# Altium project ENGG3800S2_DANCEMACHINE_REV2.PrjPcb (part 2 of 2)

## Sheet INTERFACE_rev2.SchDoc
size A4; SheetNumber: 7; SheetTotal: 11
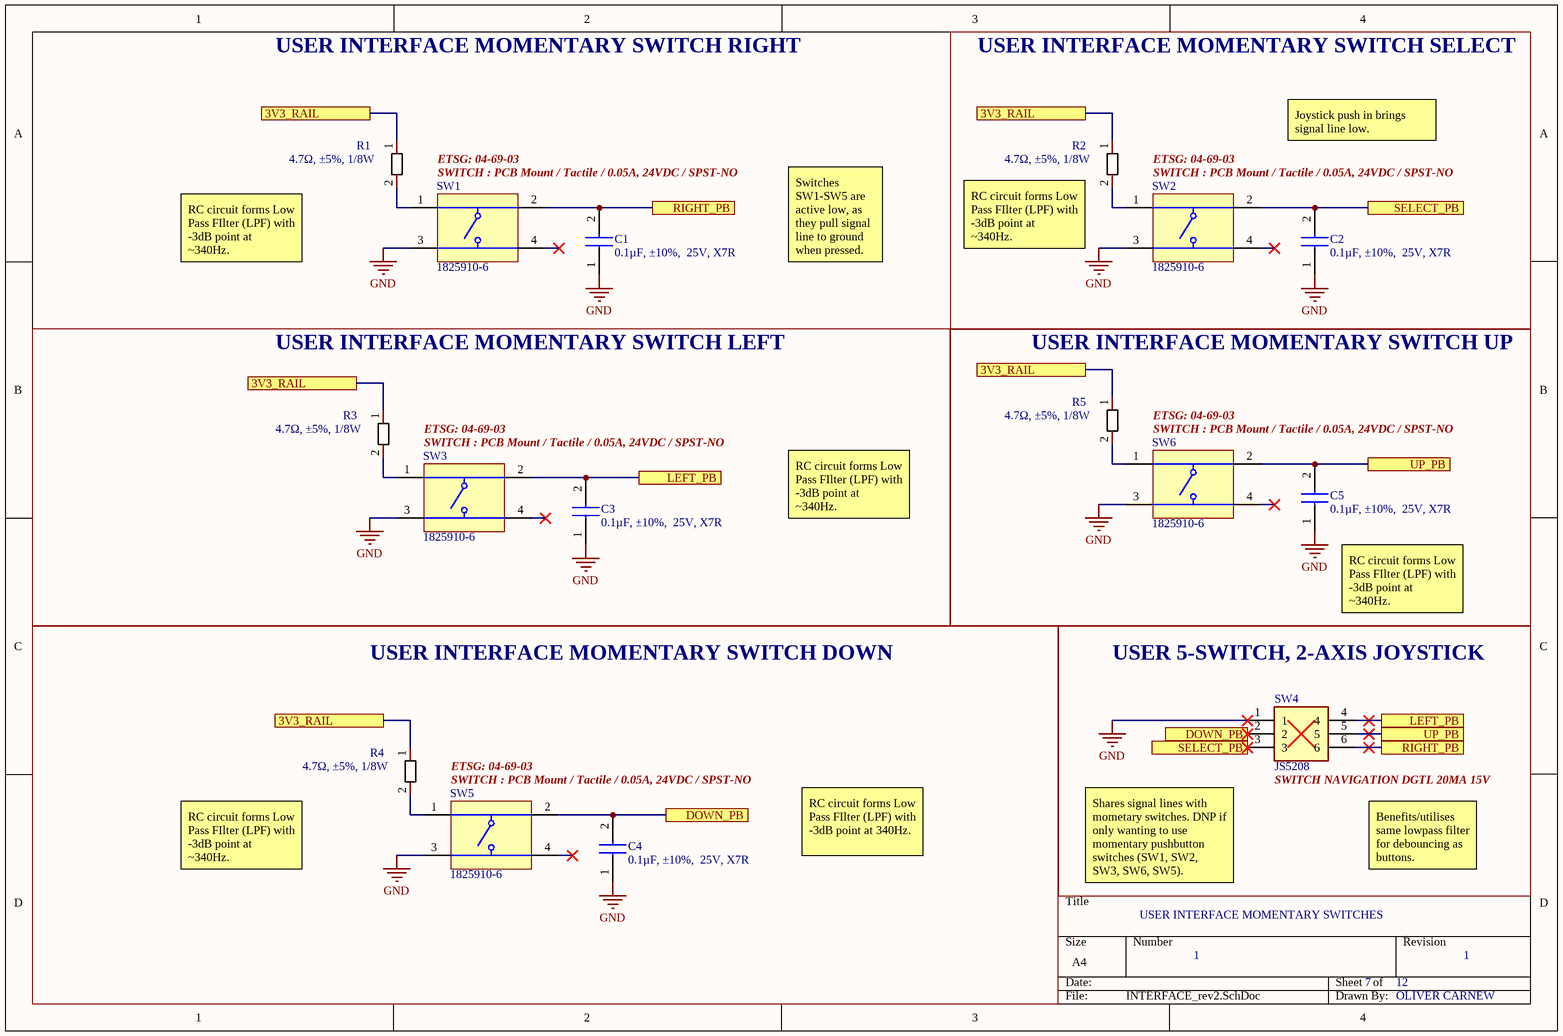
[diagram p6: INTERFACE_rev2.SchDoc]

### Parts
(Parts that share a designator on the sheet are numbered #1, #2 ... from top to bottom, then left to right.)
*#5  NC  (value not drawn)
C1  0.1µF, ±10%,  25V, X7R  [CAPC1005X55N]
C2  0.1µF, ±10%,  25V, X7R  [CAPC1005X55N]
C3  0.1µF, ±10%,  25V, X7R  [CAPC1005X55N]
C4  0.1µF, ±10%,  25V, X7R  [CAPC1005X55N]
C5  0.1µF, ±10%,  25V, X7R  [CAPC1005X55N]
R1  4.7Ω, ±5%, 1/8W  [SURFM RESISTOR]
R2  4.7Ω, ±5%, 1/8W  [SURFM RESISTOR]
R3  4.7Ω, ±5%, 1/8W  [SURFM RESISTOR]
R4  4.7Ω, ±5%, 1/8W  [SURFM RESISTOR]
R5  4.7Ω, ±5%, 1/8W  [SURFM RESISTOR]
SW1  1825910-6  [TECO-1825910-6_V]
SW2  1825910-6  [TECO-1825910-6_V]
SW3  1825910-6  [TECO-1825910-6_V]
SW4  JS5208  [JS5208]
SW5  1825910-6  [TECO-1825910-6_V]
SW6  1825910-6  [TECO-1825910-6_V]

### Blocks framed on the sheet
USER INTERFACE MOMENTARY SWITCH SELECT: C2 R2 SW2
USER INTERFACE MOMENTARY SWITCH LEFT: C3 R3 SW3
USER INTERFACE MOMENTARY SWITCH UP: C5 R5 SW6
USER INTERFACE MOMENTARY SWITCH DOWN: C4 R4 SW5
USER 5-SWITCH, 2-AXIS JOYSTICK: *#5 SW4

### Ports
3V3_RAIL, DOWN_PB, LEFT_PB, RIGHT_PB, SELECT_PB, UP_PB

### Nets
+3V3: R1.1 R2.1 R3.1 R4.1 R5.1 ; port 3V3_RAIL
GND: C1.1 C2.1 C3.1 C4.1 C5.1 SW1.3 SW2.3 SW3.3 SW4.1 SW5.3 SW6.3
PB_D: C4.2 SW4.2 SW5.2 ; port DOWN_PB
PB_L: C3.2 SW3.2 SW4.4 ; port LEFT_PB
PB_Ri: C1.2 SW1.2 SW4.6 ; port RIGHT_PB
PB_Sel: C2.2 SW2.2 SW4.3 ; port SELECT_PB
PB_U: C5.2 SW4.5 SW6.2 ; port UP_PB
NetR1_2: R1.2 SW1.1
NetR2_2: R2.2 SW2.1
NetR3_2: R3.2 SW3.1
NetR4_2: R4.2 SW5.1
NetR5_2: R5.2 SW6.1

Not connected (* = marked no-connect by the designer): SW1 4*; SW2 4*; SW3 4*; SW5 4*; SW6 4*

### Notes on the sheet
- USER INTERFACE MOMENTARY SWITCH RIGHT
- SWITCH : PCB Mount / Tactile / 0.05A, 24VDC / SPST-NO
- ETSG: 04-69-03
- Joystick push in brings signal line low.
- (near R2) RC circuit forms Low Pass FIlter (LPF) with -3dB point at ~340Hz.
- RC circuit forms Low Pass FIlter (LPF) with -3dB point at ~340Hz.
- Switches SW1-SW5 are active low, as they pull signal line to ground when pressed.
- (near C5) RC circuit forms Low Pass FIlter (LPF) with -3dB point at ~340Hz.
- SWITCH NAVIGATION DGTL 20MA 15V
- RC circuit forms Low Pass FIlter (LPF) with -3dB point at 340Hz.
- Shares signal lines with mometary switches. DNP if only wanting to use momentary pushbutton switches (SW1, SW2, SW3, SW6, SW5).
- USER INTERFACE MOMENTARY SWITCHES
- Benefits/utilises same lowpass filter for debouncing as buttons.
- 1
- 7
- 12
- OLIVER CARNEW

### Library data of the parts
C1-C5 = CL05B104KA5NNNC: Capacitor CAP CER 0.1UF 25V X7R 0402 CL05B104KA5NNNC; Manufacturer_Name: SAMSUNG; Datasheet Link: https://datasheet.datasheetarchive.com/originals/distributors/DKDS-19/372989.pdf; Height: 0.55mm; Manufacturer_Part_Number: CL05B104KA5NNNC; Mouser Part Number: 187-CL05B104KA5NNNC; Mouser Price/Stock: https://www.mouser.co.uk/ProductDetail/Samsung-Electro-Mechanics/CL05B104KA5NNNC?qs=Efv9o2T6U88DLyyMSzjXSQ%3D%3D; Arrow Part Number: CL05B104KA5NNNC; Arrow Price/Stock: https://www.arrow.com/en/products/cl05b104ka5nnnc/samsung-electro-mechanics?region=nac; Parameter 1: Capacitor CAP CER 0.1UF 25V X7R 0402 CL05B104KA5NNNC
R1-R5 = 0805-R: Chip Resistor, 4.7 KOhm, +/- 1%, 0.1 W, -55 to 155 degC, 0603 (1608 Metric), RoHS, Tape and Reel RC0603FR-074K7L
SW1-SW3 SW5 SW6 = CMP-1684-00021-1: Tact Switch, SPST-NO, 0.05 A, -35 to 85 degC, 4-Pin THD, RoHS, Bulk; Manufacturer: TE Connectivity; Maximum Contact Resistance: 100mOhm; Mechanical Life: 100000Cycles; Bushing Type: Unthreaded; Switch Configuration: OFF(ON); Maximum DC Voltage Rating: 24V; Contact Rating @ Voltage: 0.05A@24VDC; Actuator Color: Black; Body Orientation: Straight; Function: MomentaryContact; Illumination: N/R; Actuator Style: RoundButton; Actuator Material: PolybutyleneTerephthalate; Dielectric Strength: 500VAC; Pole Throw Configuration: SPST; Actuator Length: 1.4mm; Product Weight: N/A; Contact Material: CopperAlloy; Housing Material: N/A; Terminal Type: PCPins; Minimum Insulation Resistance: 100MOhm; Package Description: 4-Pin Through Hole Device, Body 5.99 x 5.99 mm, Pitch 6.5 mm; Part No: 1825910-6; Package Reference: THD; Base Material: N/A; Manufacturer URL: http://www.te.com; Contact Plating: Silver; RoHS: Yes; Datasheet Version: Rev. C9; Electrical Life: 100000Cycles; Maximum AC Voltage Rating: N/A; Thread Size: N/R; Operating Temperature: -35to85C; Mounting: ThroughHole; Dimension: 5.99x5mm; Datasheet URL: http://www.te.com/commerce/DocumentDelivery/DDEController?Action=showdoc&DocId=Customer+Drawing%7F1825910%7FC9%7Fpdf%7FEnglish%7FENG_CD_1825910_C9.pdf%7F1825910-6; Family: 1825910; Seal Location: N/A; Seal Description: N/A; Packaging: N/A
SW4 = JS5208: Switch; Manufacturer_Name: E-Switch; Datasheet Link: https://configured-product-images.s3.amazonaws.com/2D/specs/JS5208.pdf; Height: 12.2mm; Manufacturer_Part_Number: JS5208; Mouser Part Number: 612-JS5208; Mouser Price/Stock: https://www.mouser.co.uk/ProductDetail/E-Switch/JS5208?qs=f57gQzlyLiqOzqNCAUlPQg%3D%3D

## Sheet ARCADE_BUTTONS.SchDoc
size A4; SheetNumber: 8; SheetTotal: 11
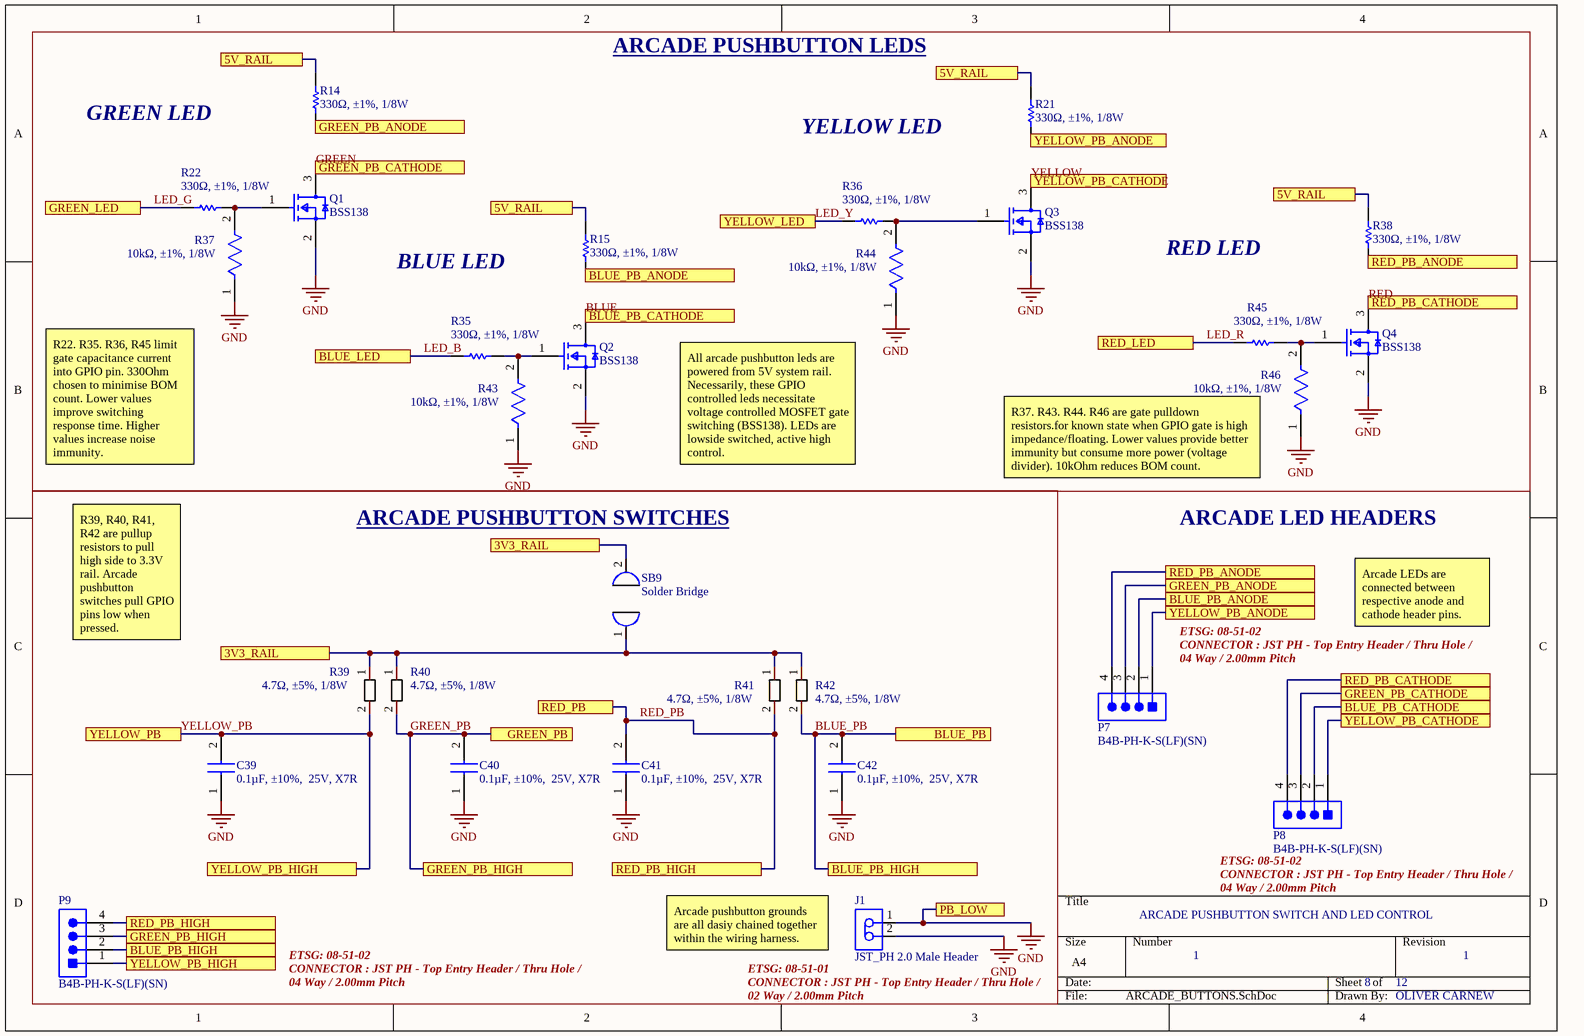
[diagram p7: ARCADE_BUTTONS.SchDoc]

### Parts
(Parts that share a designator on the sheet are numbered #1, #2 ... from top to bottom, then left to right.)
C39  0.1µF, ±10%,  25V, X7R  [CAPC1005X55N]
C40  0.1µF, ±10%,  25V, X7R  [CAPC1005X55N]
C41  0.1µF, ±10%,  25V, X7R  [CAPC1005X55N]
C42  0.1µF, ±10%,  25V, X7R  [CAPC1005X55N]
J1  JST_PH 2.0 Male Header  [JST-B2B-PH-K-S_V]
P7#1  B4B-PH-K-S(LF)(SN)  [JST-B4B-PH-K-S_V]
P8#1  B4B-PH-K-S(LF)(SN)  [JST-B4B-PH-K-S_V]
P9#1  B4B-PH-K-S(LF)(SN)  [JST-B4B-PH-K-S_V]
Q1  BSS138  [FP-318-08-IPC_B]
Q2  BSS138  [FP-318-08-IPC_B]
Q3  BSS138  [FP-318-08-IPC_B]
Q4  BSS138  [FP-318-08-IPC_B]
R14  330Ω, ±1%, 1/8W  [RESC1608X55X30ML20T10]
R15  330Ω, ±1%, 1/8W  [RESC1608X55X30ML20T10]
R21  330Ω, ±1%, 1/8W  [RESC1608X55X30ML20T10]
R22  330Ω, ±1%, 1/8W  [RESC1608X55X30ML20T10]
R35  330Ω, ±1%, 1/8W  [RESC1608X55X30ML20T10]
R36  330Ω, ±1%, 1/8W  [RESC1608X55X30ML20T10]
R37  10kΩ, ±1%, 1/8W  [FP-MCT0603-MFG]
R38  330Ω, ±1%, 1/8W  [RESC1608X55X30ML20T10]
R39  4.7Ω, ±5%, 1/8W  [SURFM RESISTOR]
R40  4.7Ω, ±5%, 1/8W  [SURFM RESISTOR]
R41  4.7Ω, ±5%, 1/8W  [SURFM RESISTOR]
R42  4.7Ω, ±5%, 1/8W  [SURFM RESISTOR]
R43  10kΩ, ±1%, 1/8W  [FP-MCT0603-MFG]
R44  10kΩ, ±1%, 1/8W  [FP-MCT0603-MFG]
R45  330Ω, ±1%, 1/8W  [RESC1608X55X30ML20T10]
R46  10kΩ, ±1%, 1/8W  [FP-MCT0603-MFG]
SB9  Solder Bridge  [SOLDER BRIDGE OPEN SMALL]

### Blocks framed on the sheet
ARCADE PUSHBUTTON SWITCHES: C39-C42 J1 P9#1 R39-R42 SB9

### Ports
3V3_RAIL, 5V_RAIL, BLUE_LED, BLUE_PB, BLUE_PB_ANODE, BLUE_PB_CATHODE, BLUE_PB_HIGH, GREEN_LED, GREEN_PB, GREEN_PB_ANODE, GREEN_PB_CATHODE, GREEN_PB_HIGH, PB_LOW, RED_LED, RED_PB, RED_PB_ANODE, RED_PB_CATHODE, RED_PB_HIGH, YELLOW_LED, YELLOW_PB, YELLOW_PB_ANODE, YELLOW_PB_CATHODE, YELLOW_PB_HIGH

### Nets
+3V3: R39.1 R40.1 R41.1 R42.1 SB9.1 SB9.2 ; port 3V3_RAIL
GND: C39.1 C40.1 C41.1 C42.1 J1.1 J1.2 Q1.2(S) Q2.2(S) Q3.2(S) Q4.2(S) R37.1 R43.1 R44.1 R46.1 ; port PB_LOW
V_SYS_IN: R14.2 R15.2 R21.2 R38.2 ; port 5V_RAIL
BLUE: P8#1.2 Q2.3(D) ; port BLUE_PB_CATHODE
BLUE_PB: C42.2 P9#1.2 R42.2 ; port BLUE_PB, port BLUE_PB_HIGH
GREEN: P8#1.3 Q1.3(D) ; port GREEN_PB_CATHODE
GREEN_PB: C40.2 P9#1.3 R40.2 ; port GREEN_PB, port GREEN_PB_HIGH
LED_B: R35.2 ; port BLUE_LED
LED_G: R22.2 ; port GREEN_LED
LED_R: R45.2 ; port RED_LED
LED_Y: R36.2 ; port YELLOW_LED
RED: P8#1.4 Q4.3(D) ; port RED_PB_CATHODE
RED_PB: C41.2 P9#1.4 R41.2 ; port RED_PB, port RED_PB_HIGH  [project net PB_Red]
YELLOW: P8#1.1 Q3.3(D) ; port YELLOW_PB_CATHODE
YELLOW_PB: C39.2 P9#1.1 R39.2 ; port YELLOW_PB, port YELLOW_PB_HIGH  [project net PB_Y]
NetP7#1_1: P7#1.1 R21.1 ; port YELLOW_PB_ANODE
NetP7#1_2: P7#1.2 R15.1 ; port BLUE_PB_ANODE
NetP7#1_3: P7#1.3 R14.1 ; port GREEN_PB_ANODE
NetP7#1_4: P7#1.4 R38.1 ; port RED_PB_ANODE
NetQ1_1: Q1.1(G) R22.1 R37.2
NetQ2_1: Q2.1(G) R35.1 R43.2
NetQ3_1: Q3.1(G) R36.1 R44.2
NetQ4_1: Q4.1(G) R45.1 R46.2

### Notes on the sheet
- ARCADE PUSHBUTTON LEDS
- GREEN LED
- YELLOW LED
- BLUE LED
- RED LED
- R22. R35. R36, R45 limit gate capacitance current into GPIO pin. 330Ohm chosen to minimise BOM count. Lower values improve switching response time. Higher values increase noise immunity.
- All arcade pushbutton leds are powered from 5V system rail. Necessarily, these GPIO controlled leds necessitate voltage controlled MOSFET gate switching (BSS138). LEDs are lowside switched, active high control.
- R37. R43. R44. R46 are gate pulldown resistors.for known state when GPIO gate is high impedance/floating. Lower values provide better immunity but consume more power (voltage divider). 10kOhm reduces BOM count.
- ARCADE LED HEADERS
- R39, R40, R41, R42 are pullup resistors to pull high side to 3.3V rail. Arcade pushbutton switches pull GPIO pins low when pressed.
- ETSG: 08-51-02
- (near P7#1) CONNECTOR : JST PH - Top Entry Header / Thru Hole /
- Arcade LEDs are connected between respective anode and cathode header pins.
- (near P7#1) 04 Way / 2.00mm Pitch
- ARCADE PUSHBUTTON SWITCH AND LED CONTROL
- CONNECTOR : JST PH - Top Entry Header / Thru Hole /
- 04 Way / 2.00mm Pitch
- Arcade pushbutton grounds are all dasiy chained together within the wiring harness.
- ETSG: 08-51-01
- (near J1) CONNECTOR : JST PH - Top Entry Header / Thru Hole /
- 1
- 8
- 12
- 02 Way / 2.00mm Pitch
- OLIVER CARNEW

### Library data of the parts
C39-C42 = CL05B104KA5NNNC: as C1 on sheet INTERFACE_rev2; Datasheet Link: https://datasheet.datasheetarchive.com/originals/distributors/DKDS-19/372989.pdf; Height: 0.55mm; Manufacturer_Part_Number: CL05B104KA5NNNC; Mouser Part Number: 187-CL05B104KA5NNNC; Mouser Price/Stock: https://www.mouser.co.uk/ProductDetail/Samsung-Electro-Mechanics/CL05B104KA5NNNC?qs=Efv9o2T6U88DLyyMSzjXSQ%3D%3D; Arrow Part Number: CL05B104KA5NNNC; Arrow Price/Stock: https://www.arrow.com/en/products/cl05b104ka5nnnc/samsung-electro-mechanics?region=nac; Parameter 1: Capacitor CAP CER 0.1UF 25V X7R 0402 CL05B104KA5NNNC
J1 = CMP-2000-05162-1: Male Header, Pitch 2 mm, 1 x 2 Position, Height 6 mm, Tail Length 3.4 mm, -25 to 85 degC, RoHS, Bulk B2B-PH-K-S(LF)(SN) / CONNECTOR : JST PH - Top Entry Header / Thru Hole / 02 Way / 2.00mm Pitch ___ 08-51-01; Pitch: 2mm; Style/Orientation: StraightHeader/Plug; No of Positions: 2; Datasheet Version: Nov-08; Datasheet URL: http://datasheet.octopart.com/B2B-PH-K-S%28LF%29%28SN%29-JST-datasheet-8324864.pdf; Manufacturer URL: http://www.jst.com/home2.html; Type: ShroudedHeader; Termination: Crimp; Manufacturer: JST
P7#1 P8#1 = CMP-2000-05165-1: Male Header, Pitch 2 mm, 1 x 4 Position, Height 6 mm, Tail Length 3.4 mm, -25 to 85 degC, RoHS, Bulk; Manufacturer: JST; No of Positions: 4; Style/Orientation: StraightHeader/Plug; Pitch: 2mm; Datasheet URL: http://datasheet.octopart.com/B4B-PH-K-S%28LF%29%28SN%29-JST-datasheet-10558886.pdf; Type: ShroudedHeader; Manufacturer URL: http://www.jst.com/home2.html; Termination: Crimp; Datasheet Version: Apr-09
P9#1 = CMP-2000-05165-1: Male Header, Pitch 2 mm, 1 x 4 Position, Height 6 mm, Tail Length 3.4 mm, -25 to 85 degC, RoHS, Bulk CONNECTOR : JST PH - Top Entry Header / Thru Hole / 04 Way / 2.00mm Pitch. ETSG: 08-51-02; No of Positions: 4; Style/Orientation: StraightHeader/Plug; Pitch: 2mm; Manufacturer: JST; Datasheet URL: http://datasheet.octopart.com/B4B-PH-K-S%28LF%29%28SN%29-JST-datasheet-10558886.pdf; Type: ShroudedHeader; Manufacturer URL: http://www.jst.com/home2.html; Termination: Crimp; Datasheet Version: Apr-09
Q1-Q4 = CMP-07173-000101-1: MOSFET N-CH 50V 220MA SOT-23; Turn-Off Delay Time: 20ns; Element Configuration: Single; Rds On Max: 3.5R; Gate to Source Voltage (Vgs): 20V; Threshold Voltage: 1.3V; Number of Elements: 1; Power Dissipation: 360mW; Rise Time: 9ns; Turn-On Delay Time: 2.5ns; Input Capacitance: 27pF; On-State Resistance: 6R; Lead Free: Lead Free; Length: 2.92mm; Width: 1.3mm; Drain to Source Breakdown Voltage: 50V; Min Operating Temperature: -55°C; REACH SVHC: No SVHC; Packaging: Tape and Reel; Radiation Hardening: No; Height: 0.93mm; Drain to Source Voltage (Vdss): 50V; Current Rating: 220mA; Voltage Rating (DC): 50V; Weight: 0.03g; Continuous Drain Current (ID): 220mA; Number of Pins: 3; Nominal Vgs: 1.3V; Max Power Dissipation: 360mW; Fall Time: 9ns; Drain to Source Resistance: 3.5R; Contact Plating: Tin; Case/Package: SOT-23; Package Quantity: 1; Dual Supply Voltage: 50V; Mount: Surface Mount; Termination: SMD/SMT; Max Operating Temperature: 150°C
R14 R15 R21 R22 R35 R36 R38 R45 = CMP-2000-01422-1: RK73H1JTTD3300F 330 Ohms ±1% 0.125W, 1/8W Chip Resistor 0603 (1608 Metric) Automotive AEC-Q200 Thick Film; Manufacturer: KOA Speer; Part Number: RK73H1JTTD3300F
R37 R43 R44 R46 = CMP-02407-001346-1: RES SMD 10KOHM 1% 1/8W 0603 MCT0603MC1002FP500; Voltage Rating: 75V; Power Rating: 125mW; Resistance: 10kR; Length: 1.6mm; Case Code (Metric): 1608; Composition: Thin Film; Height: 0.45mm; Weight: 7.1E-05oz; Min Operating Temperature: -55°C; Packaging: Tape and Reel; Width: 0.8mm; Case/Package: 0603; Tolerance: 1%; Termination: SMD/SMT; Package Quantity: 5000; Case Code (Imperial): 0603; Max Operating Temperature: 155°C
R39-R42 = 0805-R: as R1 on sheet INTERFACE_rev2
SB9 = SOLDER_BRIDGE_TDROP: Tension Fill Solder Bridge

## Sheet TP_STD_PERIPHERALS.SchDoc
size A4; SheetNumber: 9; SheetTotal: 11
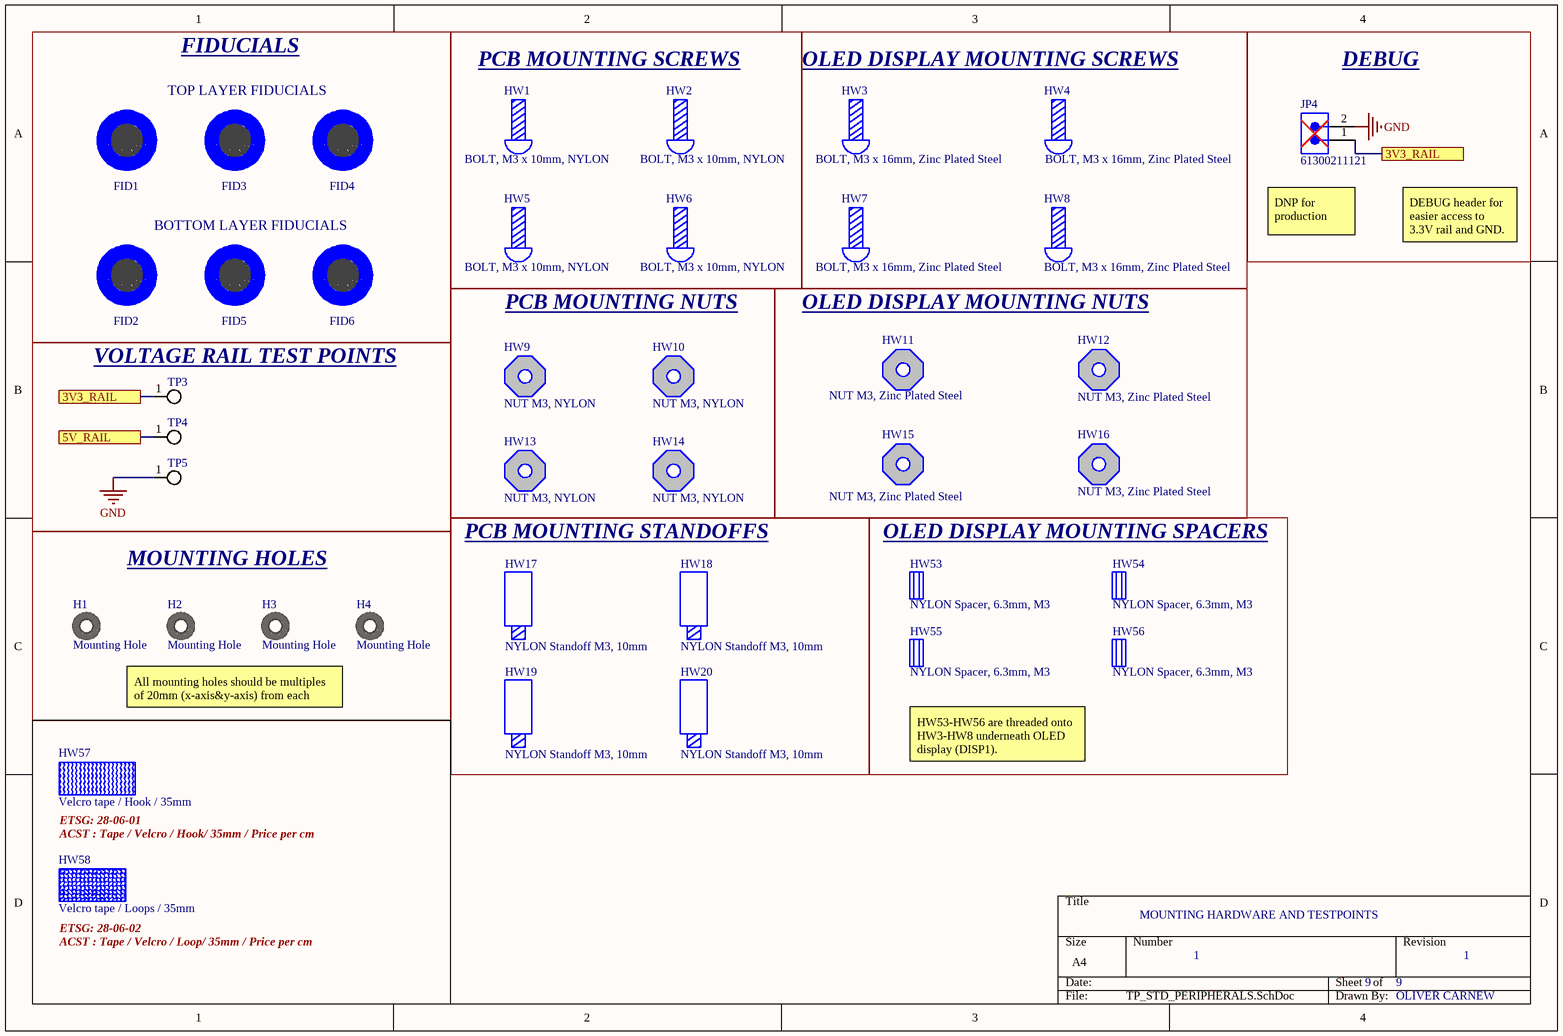
[diagram p8: TP_STD_PERIPHERALS.SchDoc]

### Parts
(Parts that share a designator on the sheet are numbered #1, #2 ... from top to bottom, then left to right.)
*#6  NC  (value not drawn)
FID1  Fiducial Mark  [FIDUCIAL_SMALL]  (value not drawn)
FID2  Fiducial Mark  [FIDUCIAL_SMALL]  (value not drawn)
FID3  Fiducial Mark  [FIDUCIAL_SMALL]  (value not drawn)
FID4  Fiducial Mark  [FIDUCIAL_SMALL]  (value not drawn)
FID5  Fiducial Mark  [FIDUCIAL_SMALL]  (value not drawn)
FID6  Fiducial Mark  [FIDUCIAL_SMALL]  (value not drawn)
H1  Mounting Hole  [M3_MOUNTING_HOLE_3_4_mm]
H2  Mounting Hole  [M3_MOUNTING_HOLE_3_4_mm]
H3  Mounting Hole  [M3_MOUNTING_HOLE_3_4_mm]
H4  Mounting Hole  [M3_MOUNTING_HOLE_3_4_mm]
HW1  BOLT, M3 x 10mm, NYLON
HW2  BOLT, M3 x 10mm, NYLON
HW3  BOLT, M3 x 16mm, Zinc Plated Steel
HW4  BOLT, M3 x 16mm, Zinc Plated Steel
HW5  BOLT, M3 x 10mm, NYLON
HW6  BOLT, M3 x 10mm, NYLON
HW7  BOLT, M3 x 16mm, Zinc Plated Steel
HW8  BOLT, M3 x 16mm, Zinc Plated Steel
HW9  NUT M3, NYLON
HW10  NUT M3, NYLON
HW11  NUT M3, Zinc Plated Steel
HW12  NUT M3, Zinc Plated Steel
HW13  NUT M3, NYLON
HW14  NUT M3, NYLON
HW15  NUT M3, Zinc Plated Steel
HW16  NUT M3, Zinc Plated Steel
HW17  NYLON Standoff M3, 10mm
HW18  NYLON Standoff M3, 10mm
HW19  NYLON Standoff M3, 10mm
HW20  NYLON Standoff M3, 10mm
HW53  NYLON Spacer, 6.3mm, M3
HW54  NYLON Spacer, 6.3mm, M3
HW55  NYLON Spacer, 6.3mm, M3
HW56  NYLON Spacer, 6.3mm, M3
HW57  Velcro tape / Hook / 35mm
HW58  Velcro tape / Loops / 35mm
JP4  61300211121  [61300211121]
TP3  Small testpoint 40mil  [TEST_POINT_SMALL]  (value not drawn)
TP4  Small testpoint 40mil  [TEST_POINT_SMALL]  (value not drawn)
TP5  Small testpoint 40mil  [TEST_POINT_SMALL]  (value not drawn)

### Blocks framed on the sheet
FIDUCIALS: FID1-FID6
PCB MOUNTING SCREWS: HW1 HW2 HW5 HW6
OLED DISPLAY MOUNTING SCREWS: HW3 HW4 HW7 HW8
DEBUG: *#6 JP4
PCB MOUNTING NUTS: HW9 HW10 HW13 HW14
OLED DISPLAY MOUNTING NUTS: HW11 HW12 HW15 HW16
VOLTAGE RAIL TEST POINTS: TP3-TP5
PCB MOUNTING STANDOFFS: HW17-HW20
OLED DISPLAY MOUNTING SPACERS: HW53-HW56
MOUNTING HOLES: H1-H4

### Ports
3V3_RAIL, 5V_RAIL

### Nets
+3V3: JP4.1 TP3.1 ; port 3V3_RAIL
GND: JP4.2 TP5.1
V_SYS_IN: TP4.1 ; port 5V_RAIL

### Notes on the sheet
- TOP LAYER FIDUCIALS
- BOTTOM LAYER FIDUCIALS
- DNP for production
- DEBUG header for easier access to 3.3V rail and GND.
- All mounting holes should be multiples of 20mm (x-axis&y-axis) from each other.
- HW53-HW56 are threaded onto HW3-HW8 underneath OLED display (DISP1).
- (near HW57) ETSG: 28-06-01
- (near HW57) ACST : Tape / Velcro / Hook/ 35mm / Price per cm
- MOUNTING HARDWARE AND TESTPOINTS
- (near HW58) ETSG: 28-06-02
- (near HW58) ACST : Tape / Velcro / Loop/ 35mm / Price per cm
- 1
- 9
- OLIVER CARNEW

### Library data of the parts
FID1-FID6 = FIDUCIAL_SMALL: Small 1mm/40mil pad with 40mm soldermask clearance
H1-H4 = M3_MOUNTING_HOLE: M3 Mounting hole (3.4mm)
HW1-HW8 = M3_SCREW
HW9-HW16 = NUT
HW17-HW20 = STANDOFF
HW53-HW56 = NYLON_STANDOFF_6_3_mm: Spacer / Female - Female / Nylon / Hexagonal / M3 x 06.3
HW57 = VELCRO_HOOKS: ETSG: 28-06-01 / ACST : Tape / Velcro / Hook / / 20mm / Price per cm
HW58 = VELCRO_LOOP: ETSG: 28-06-01 / ACST : Tape / Velcro / Hook / / 20mm / Price per cm
JP4 = CMP-1712-00002-6: NexarPartId: 20081794; Number of Contacts: 2; Pitch: 2.54mm; Connector Type: Male Pin; Voltage Rating: 250V; Current Rating: 3A; Gender: Male; Contact Resistance: 20mΩ; Height: 8.94mm; Lead Free: Lead Free; Number of Pins: 2; Termination: Through Hole; RoHS: Compliant; Lead Pitch: 2.54mm; REACH SVHC: No SVHC; Housing Material: PBT; Contact Mating Length: 5.9944mm; Min Operating Temperature: -40°C; Orientation: Vertical; Contact Material: Copper; Contact Gender: Male; Max Operating Temperature: 125°C; Number of Rows: 1; Number of Positions: 2; Packaging: Bulk; Contact Plating: Gold; Mount: Through Hole; Color: Black; Operating Supply Voltage: 250V
TP3-TP5 = TEST_POINT_SMALL: 40mil circular pad no hole

## Sheet CONNECTORS_WIRES.SchDoc
size A4; SheetNumber: 10; SheetTotal: 12
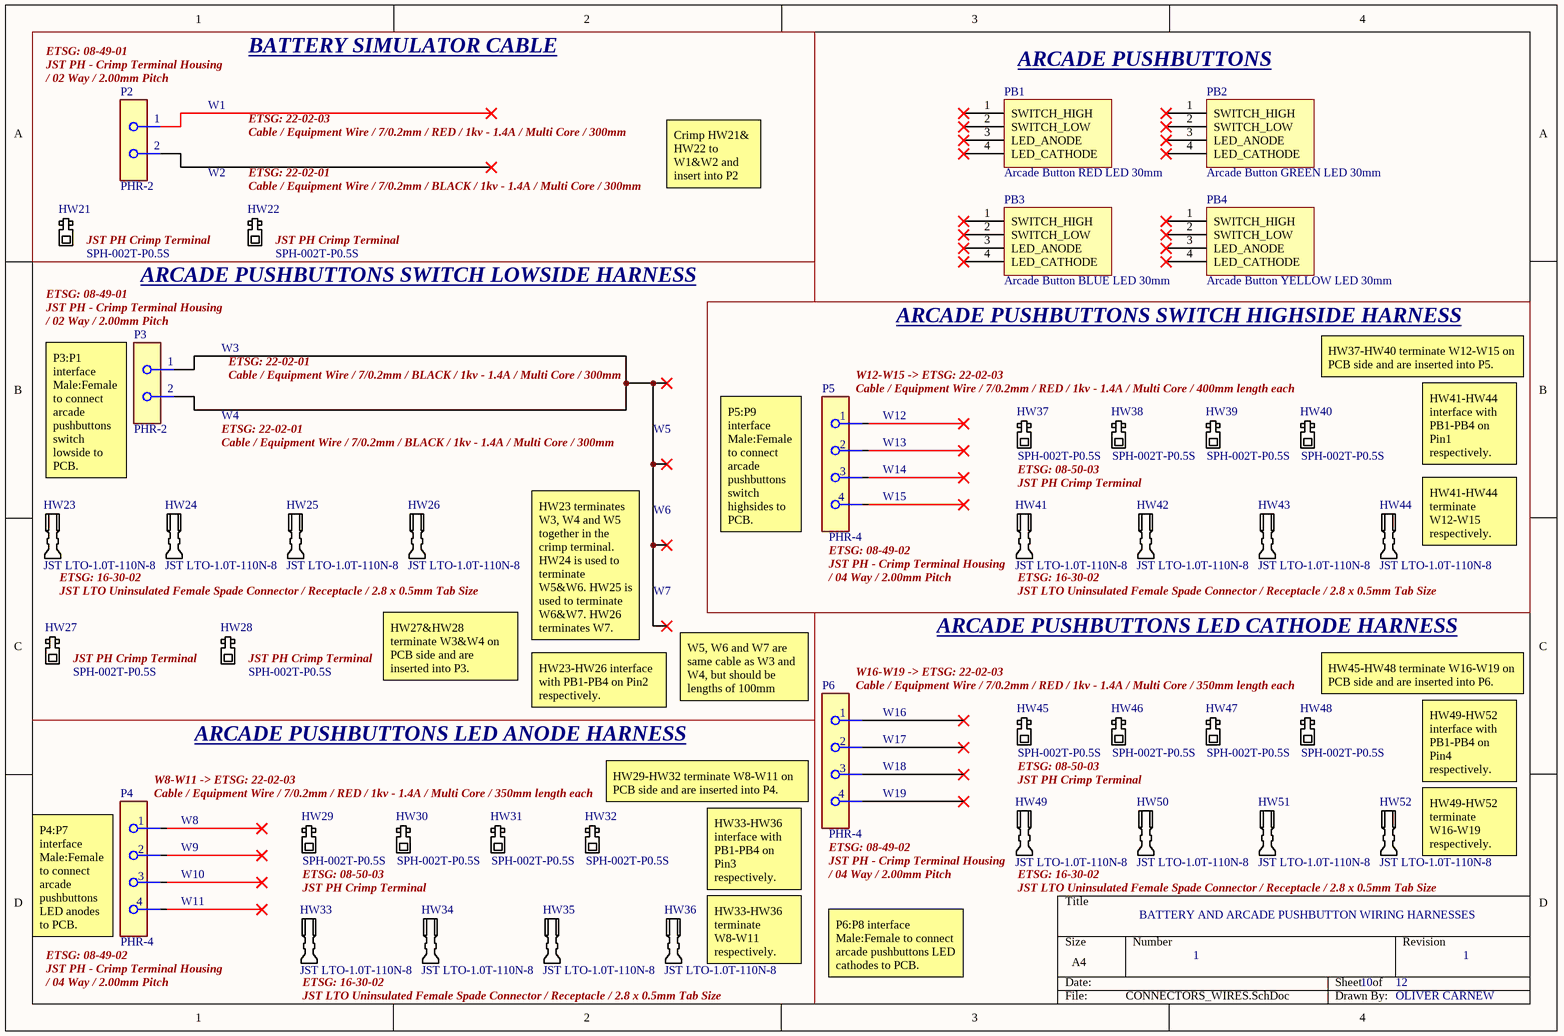
[diagram p9: CONNECTORS_WIRES.SchDoc]

### Parts
(Parts that share a designator on the sheet are numbered #1, #2 ... from top to bottom, then left to right.)
HW21  SPH-002T-P0.5S
HW22  SPH-002T-P0.5S
HW23  JST LTO-1.0T-110N-8
HW24  JST LTO-1.0T-110N-8
HW25  JST LTO-1.0T-110N-8
HW26  JST LTO-1.0T-110N-8
HW27  SPH-002T-P0.5S
HW28  SPH-002T-P0.5S
HW29  SPH-002T-P0.5S
HW30  SPH-002T-P0.5S
HW31  SPH-002T-P0.5S
HW32  SPH-002T-P0.5S
HW33  JST LTO-1.0T-110N-8
HW34  JST LTO-1.0T-110N-8
HW35  JST LTO-1.0T-110N-8
HW36  JST LTO-1.0T-110N-8
HW37  SPH-002T-P0.5S
HW38  SPH-002T-P0.5S
HW39  SPH-002T-P0.5S
HW40  SPH-002T-P0.5S
HW41  JST LTO-1.0T-110N-8
HW42  JST LTO-1.0T-110N-8
HW43  JST LTO-1.0T-110N-8
HW44  JST LTO-1.0T-110N-8
HW45  SPH-002T-P0.5S
HW46  SPH-002T-P0.5S
HW47  SPH-002T-P0.5S
HW48  SPH-002T-P0.5S
HW49  JST LTO-1.0T-110N-8
HW50  JST LTO-1.0T-110N-8
HW51  JST LTO-1.0T-110N-8
HW52  JST LTO-1.0T-110N-8
P2  PHR-2  [FP-PHR-2-MFG]
P3#1  PHR-2  [FP-PHR-2-MFG]
P4#1  PHR-4  [FP-PHR-4-MFG]
P5#1  PHR-4  [FP-PHR-4-MFG]
P6#1  PHR-4  [FP-PHR-4-MFG]
PB1  Arcade Button RED LED 30mm
PB2  Arcade Button GREEN LED 30mm
PB3  Arcade Button BLUE LED 30mm
PB4  Arcade Button YELLOW LED 30mm

### Blocks framed on the sheet
BATTERY SIMULATOR CABLE: HW21 HW22 P2
ARCADE PUSHBUTTONS SWITCH HIGHSIDE HARNESS: HW37-HW44 P5#1

### Nets

Not connected (* = marked no-connect by the designer): PB1 1(SWITCH_HIGH)* 2(SWITCH_LOW)* 3(LED_ANODE)* 4(LED_CATHODE)*; PB2 1(SWITCH_HIGH)* 2(SWITCH_LOW)* 3(LED_ANODE)* 4(LED_CATHODE)*; PB3 1(SWITCH_HIGH)* 2(SWITCH_LOW)* 3(LED_ANODE)* 4(LED_CATHODE)*; PB4 1(SWITCH_HIGH)* 2(SWITCH_LOW)* 3(LED_ANODE)* 4(LED_CATHODE)*

### Notes on the sheet
- ETSG: 08-49-01
- JST PH - Crimp Terminal Housing
- / 02 Way / 2.00mm Pitch
- W1
- ARCADE PUSHBUTTONS
- (near P2) 1
- (near P2) 2
- W2
- ETSG: 22-02-03
- Cable / Equipment Wire / 7/0.2mm / RED / 1kv - 1.4A / Multi Core / 300mm
- (near HW22) ETSG: 22-02-01
- JST PH Crimp Terminal
- (near HW22) Cable / Equipment Wire / 7/0.2mm / BLACK / 1kv - 1.4A / Multi Core / 300mm
- (near HW22) JST PH Crimp Terminal
- Crimp HW21& HW22 to  W1&W2 and insert into P2
- (near HW22) ARCADE PUSHBUTTONS SWITCH LOWSIDE HARNESS
- (near P3#1) 1
- W3
- ETSG: 22-02-01
- Cable / Equipment Wire / 7/0.2mm / BLACK / 1kv - 1.4A / Multi Core / 300mm
- (near HW37) W12-W15 -> ETSG: 22-02-03
- (near HW40) HW37-HW40 terminate W12-W15 on PCB side and are inserted into P5.
- (near P3#1) 2
- W4
- W5
- Cable / Equipment Wire / 7/0.2mm / RED / 1kv - 1.4A / Multi Core / 400mm length each
- W12
- (near P5#1) W13
- (near P3#1) P3:P1 interface Male:Female to connect arcade pushbuttons switch lowside to PCB.
- W6
- (near P5#1) W14
- (near P5#1) W15
- ETSG: 08-50-03
- HW41-HW44 interface with PB1-PB4 on Pin1 respectively.
- ETSG: 16-30-02
- (near P5#1) P5:P9 interface Male:Female to connect arcade pushbuttons switch highsides to PCB.
- ETSG: 08-49-02
- (near HW41) JST PH - Crimp Terminal Housing
- (near HW41) / 04 Way / 2.00mm Pitch
- (near HW41) ETSG: 16-30-02
- (near HW44) HW41-HW44 terminate W12-W15 respectively.
- JST LTO Uninsulated Female Spade Connector / Receptacle / 2.8 x 0.5mm Tab Size
- HW23 terminates W3, W4 and W5 together in the crimp terminal. HW24 is used to terminate W5&W6. HW25 is used to terminate W6&W7. HW26 terminates W7.
- W7
- ARCADE PUSHBUTTONS LED CATHODE HARNESS
- (near HW28) JST PH Crimp Terminal
- HW27&HW28 terminate W3&W4 on PCB side and are inserted into P3.
- HW23-HW26 interface with PB1-PB4 on Pin2 respectively.
- W5, W6 and W7 are same cable as W3 and W4, but should be lengths of 100mm
- (near HW45) W16-W19 -> ETSG: 22-02-03
- Cable / Equipment Wire / 7/0.2mm / RED / 1kv - 1.4A / Multi Core / 350mm length each
- W16
- (near HW48) HW45-HW48 terminate W16-W19 on PCB side and are inserted into P6.
- (near HW29) W8-W11 -> ETSG: 22-02-03
- ARCADE PUSHBUTTONS LED ANODE HARNESS
- (near P6#1) W17
- (near P6#1) W18
- HW49-HW52 interface with PB1-PB4 on Pin4 respectively.
- W8
- (near P4#1) W9
- HW29-HW32 terminate W8-W11 on PCB side and are inserted into P4.
- (near P6#1) W19
- (near HW52) HW49-HW52 terminate W16-W19 respectively.
- (near P4#1) W10
- (near P4#1) W11
- HW33-HW36 interface with PB1-PB4 on Pin3 respectively.
- (near HW49) JST PH - Crimp Terminal Housing
- (near HW49) / 04 Way / 2.00mm Pitch
- (near HW49) ETSG: 16-30-02
- BATTERY AND ARCADE PUSHBUTTON WIRING HARNESSES
- (near P4#1) P4:P7 interface Male:Female to connect arcade pushbuttons LED anodes to PCB.
- / 04 Way / 2.00mm Pitch
- (near HW33) ETSG: 16-30-02
- (near HW36) HW33-HW36 terminate W8-W11 respectively.
- P6:P8 interface Male:Female to connect arcade pushbuttons LED cathodes to PCB.
- 1
- 10
- 12
- OLIVER CARNEW
- (in symbol CMP-17439-000059-1) 2; 3

### Library data of the parts
HW23-HW26 HW33-HW36 HW41-HW44 HW49-HW52 = JST LTO-1.0T-110N-8: JST LTO Uninsulated Female Spade Connector / Receptacle / 2.8 x 0.5mm Tab Size
P2 P3#1 = CMP-17439-000064-1: CONN HOUSING PH 2POS 2MM WHITE; Wire Gauge (Min): 24AWG; Number of Positions: 2; Gender: Female; Working Voltage: 100V; Contact Resistance: 10mR; Connector Type: Receptacle; Wire Gauge (Max): 30AWG; Max Current Rating: 2A; Insulation Resistance: 1GR; REACH SVHC: No SVHC; Contact Plating: Tin; Contact Type: Female Socket; Housing Material: Polyamide; Height: 6.4mm; Weight: 0.0625lb; Pitch: 2mm; Number of Rows: 1; Number of Contacts: 2; Mount: Free Hanging; Color: Natural; Lead Free: Lead Free; Max Operating Temperature: 85°C; Min Operating Temperature: -25°C; Length: 5.8mm; Depth: 6.85mm; Termination: Crimp; Number of Pins: 2; Max Voltage Rating (AC): 100V; Contact Material: Bronze; Housing Color: White; Current Rating: 2A; Fastening Type: Detent; Width: 4.5mm; Packaging: Bulk; Orientation: Straight; Series: PH; Flammability Rating: UL94 V-0; Material: Nylon
P4#1 P5#1 P6#1 = CMP-17439-000059-1: CONN HOUSING PH 4POS 2MM WHITE; Insulation Resistance: 1GR; Gender: Receptacle; Contact Resistance: 10mR; Number of Contacts: 4; Working Voltage: 100V; Current Rating: 2A; Min Operating Temperature: -25°C; Flammability Rating: UL94 V-0; Pitch: 2mm; Contact Plating: Tin; Lead Free: Lead Free; Color: Natural; Depth: 6.85mm; Weight: 0.0625lb; Length: 9.8mm; Height: 6.4mm; Housing Material: Nylon; REACH SVHC: No SVHC; Termination: Crimp; Series: PH; Housing Color: Natural; Connector Type: Receptacle; Number of Rows: 1; Contact Type: Female Socket; Number of Positions: 4; Fastening Type: Detent; Width: 4.5mm; Packaging: Bulk; Orientation: Straight; Material: Nylon; Max Operating Temperature: 85°C; Number of Pins: 4; Contact Material: Bronze; Mount: Free Hanging
PB1-PB4 = ARCADE_PUSHBUTTON: Ausleaf.

## Sheet LED_MATRIX.SchDoc
size A4; SheetNumber: 11; SheetTotal: 12
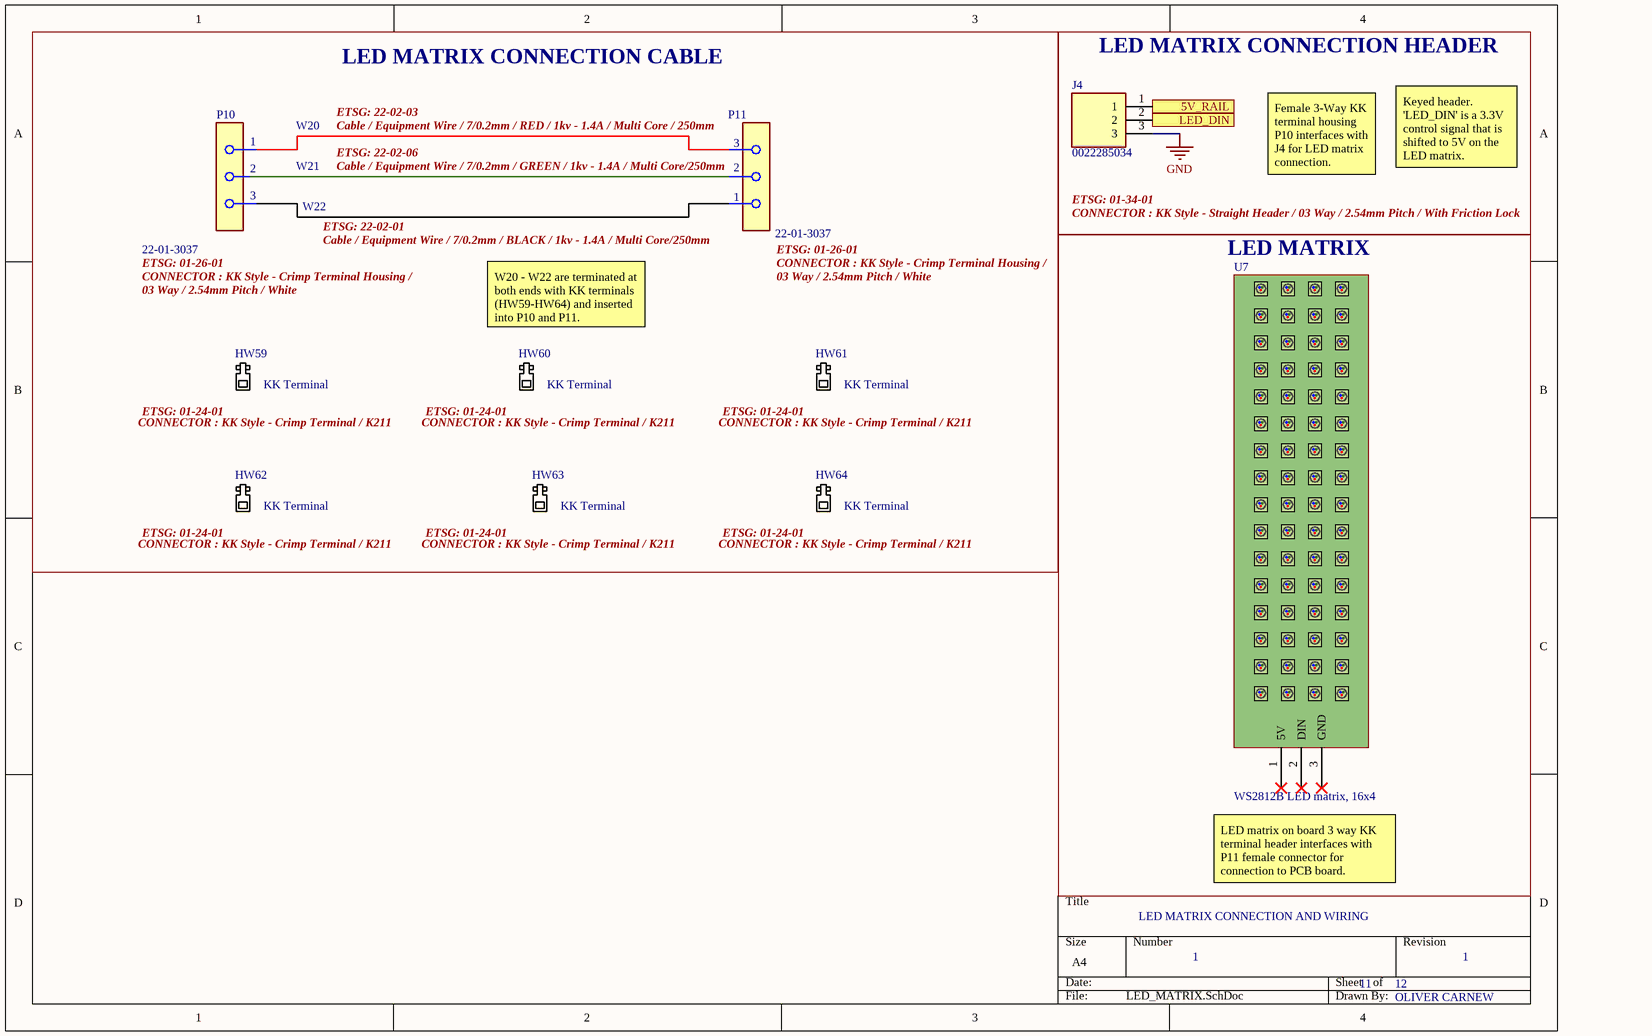
[diagram p10: LED_MATRIX.SchDoc]

### Parts
(Parts that share a designator on the sheet are numbered #1, #2 ... from top to bottom, then left to right.)
HW59  KK Terminal
HW60  KK Terminal
HW61  KK Terminal
HW62  KK Terminal
HW63  KK Terminal
HW64  KK Terminal
J4#1  0022285034  [0022285034]
P10#1  22-01-3037  [FP-22-01-3037-MFG]
P11#1  22-01-3037  [FP-22-01-3037-MFG]
U7#1  WS2812B LED matrix, 16x4

### Blocks framed on the sheet
LED MATRIX CONNECTION CABLE: HW59-HW64 P10#1 P11#1
LED MATRIX CONNECTION HEADER: J4#1
LED MATRIX: U7#1

### Ports
5V_RAIL, LED_DIN

### Nets
GND: J4#1.3
V_SYS_IN: J4#1.1 ; port 5V_RAIL
NetJ4#1_2: J4#1.2 ; port LED_DIN

Not connected (* = marked no-connect by the designer): U7#1 1(5V)* 2(DIN)* 3(GND)*

### Notes on the sheet
- ETSG: 22-02-03
- (near P10#1) 1
- (near P10#1) 2
- W20
- W21
- (near P11#1) Cable / Equipment Wire / 7/0.2mm / RED / 1kv - 1.4A / Multi Core / 250mm
- ETSG: 22-02-06
- (near P11#1) Cable / Equipment Wire / 7/0.2mm / GREEN / 1kv - 1.4A / Multi Core/250mm
- (near P11#1) 2
- (near P11#1) 3
- Female 3-Way KK terminal housing P10 interfaces with J4 for LED matrix connection.
- Keyed header. 'LED_DIN' is a 3.3V control signal that is shifted to 5V on the LED matrix.
- (near P10#1) 3
- W22
- ETSG: 22-02-01
- Cable / Equipment Wire / 7/0.2mm / BLACK / 1kv - 1.4A / Multi Core/250mm
- (near P11#1) 1
- ETSG: 01-34-01
- CONNECTOR : KK Style - Straight Header / 03 Way / 2.54mm Pitch / With Friction Lock
- ETSG: 01-26-01
- CONNECTOR : KK Style - Crimp Terminal Housing /
- 03 Way / 2.54mm Pitch / White
- (near HW60) W20 - W22 are terminated at both ends with KK terminals (HW59-HW64) and inserted into P10 and P11.
- CONNECTOR : KK Style - Crimp Terminal / K211
- (near HW59) ETSG: 01-24-01
- (near HW60) ETSG: 01-24-01
- (near HW61) ETSG: 01-24-01
- (near HW62) CONNECTOR : KK Style - Crimp Terminal / K211
- (near HW62) ETSG: 01-24-01
- (near HW63) CONNECTOR : KK Style - Crimp Terminal / K211
- (near HW63) ETSG: 01-24-01
- (near HW64) CONNECTOR : KK Style - Crimp Terminal / K211
- (near HW64) ETSG: 01-24-01
- LED MATRIX CONNECTION AND WIRING
- LED matrix on board 3 way KK terminal header interfaces with P11 female connector for connection to PCB board.
- 1
- 11
- 12
- OLIVER CARNEW

### Library data of the parts
HW59-HW64 = SPH-002T-P0.5S: CONNECTOR : KK Style - Crimp Terminal Housing / 03 Way / 2.54mm Pitch / White / ETSG 01-26-01
J4#1 = 0022285034: Connector; Manufacturer_Name: Molex; Datasheet Link: https://www.molex.com/content/dam/molex/molex-dot-com/products/automated/en-us/salesdrawingpdf/423/42375/022285034_sd.pdf?inline; Height: 10.67mm; Manufacturer_Part_Number: 0022285034; Arrow Part Number: 0022285034; Arrow Price/Stock: https://www.arrow.com/en/products/0022285034/molex?utm_currency=USD&region=nac
P10#1 P11#1 = CMP-04776-000467-1: CONN HOUS 3POS .100 W/RAMP/RIB; Number of Circuits: 3; Max Current Rating: 4A; Glow Wire Compliant: Non-compliant; Gender: Female; Connector Type: Receptacle; Approvals: UL; Voltage Rating: 250V; Pitch: 2.54mm; Halogen Free: Low Halogen; Length: 8.18mm; Depth: 12.7mm; Housing Material: Nylon; Number of Rows: 1; Termination: Crimp; Height: 4.82mm; Orientation: Straight; Housing Color: White; Material: Nylon; Max Operating Temperature: 75°C; Fastening Type: Ramp; Radiation Hardening: No; Lead Free: Lead Free; Flammability Rating: UL94 V-0; Series: 2695; Min Operating Temperature: 0°C; Number of Contacts: 3; Packaging: Bulk; Contact Material: Bronze; Number of Positions: 3; Color: White; Contact Type: Non-Gendered; Mount: Free Hanging; Width: 4.82mm
U7#1 = LED_MATRIX

## Sheet WIRING_DIAGRAM.SchDoc
size A4; SheetNumber: 12; SheetTotal: 12
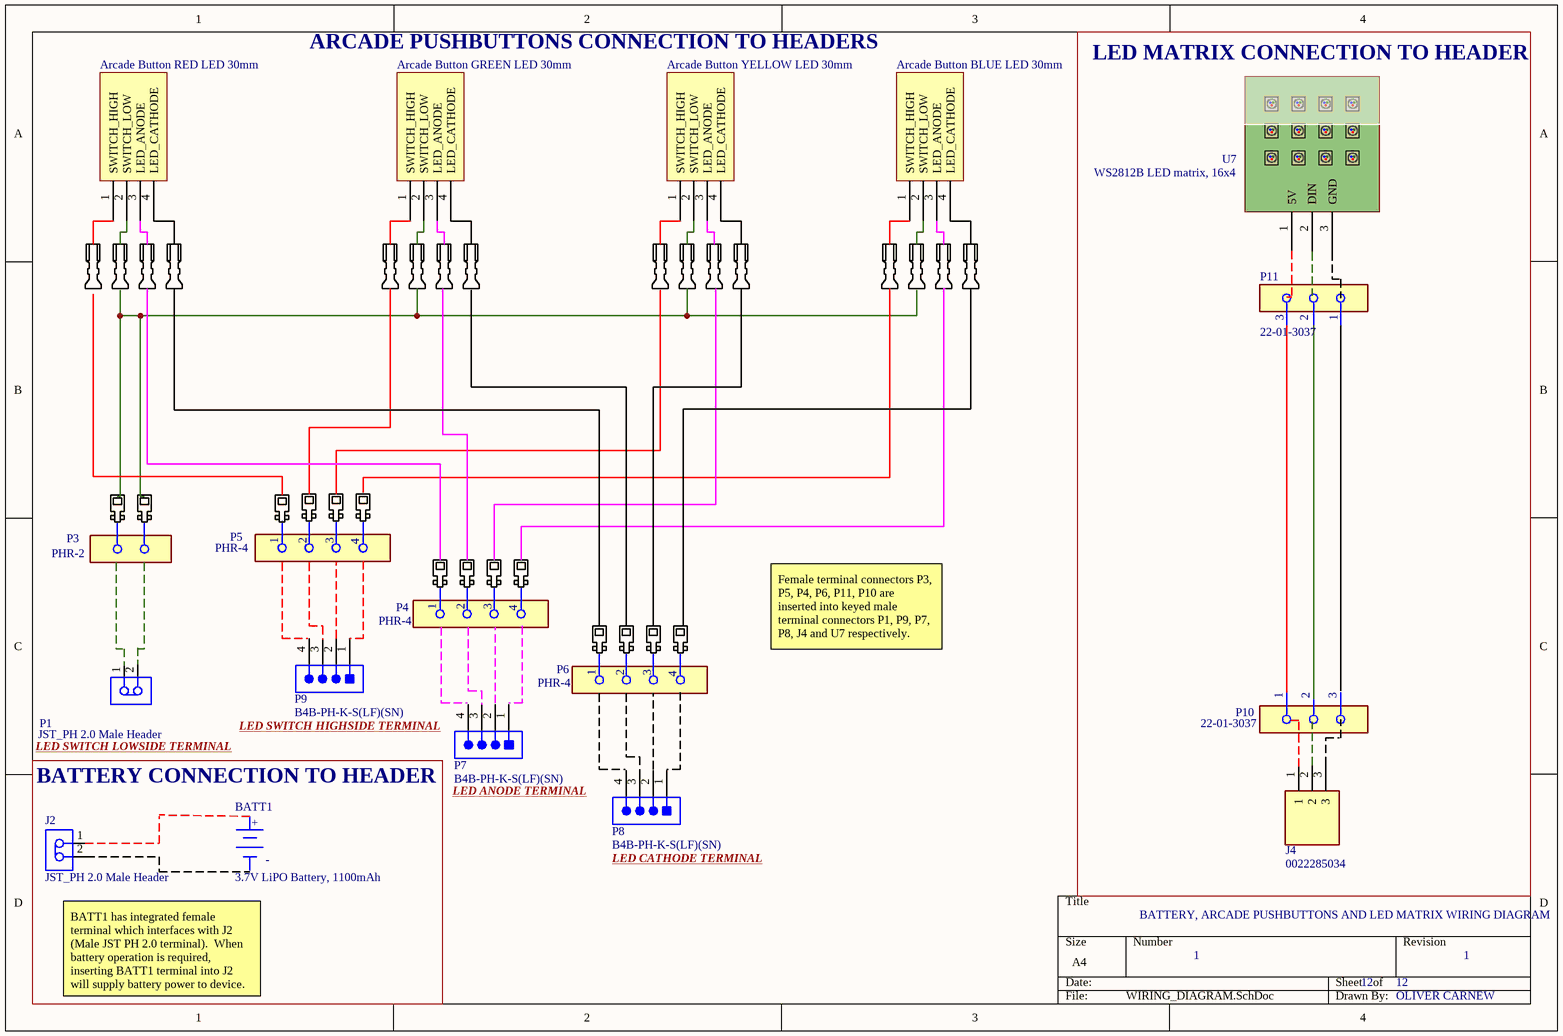
[diagram p11: WIRING_DIAGRAM.SchDoc]

### Parts
(Parts that share a designator on the sheet are numbered #1, #2 ... from top to bottom, then left to right.)
BATT1  3.7V LiPO Battery, 1100mAh  [FP-BR1225-MFG]
HW65  JST LTO-1.0T-110N-8  (value not drawn)
HW66  JST LTO-1.0T-110N-8  (value not drawn)
HW67  JST LTO-1.0T-110N-8  (value not drawn)
HW68  JST LTO-1.0T-110N-8  (value not drawn)
HW69  JST LTO-1.0T-110N-8  (value not drawn)
HW70  JST LTO-1.0T-110N-8  (value not drawn)
HW71  JST LTO-1.0T-110N-8  (value not drawn)
HW72  JST LTO-1.0T-110N-8  (value not drawn)
HW73  JST LTO-1.0T-110N-8  (value not drawn)
HW74  JST LTO-1.0T-110N-8  (value not drawn)
HW75  JST LTO-1.0T-110N-8  (value not drawn)
HW76  JST LTO-1.0T-110N-8  (value not drawn)
HW77  JST LTO-1.0T-110N-8  (value not drawn)
HW78  JST LTO-1.0T-110N-8  (value not drawn)
HW79  JST LTO-1.0T-110N-8  (value not drawn)
HW80  JST LTO-1.0T-110N-8  (value not drawn)
HW81  SPH-002T-P0.5S  (value not drawn)
HW82  SPH-002T-P0.5S  (value not drawn)
HW83  SPH-002T-P0.5S  (value not drawn)
HW84  SPH-002T-P0.5S  (value not drawn)
HW85  SPH-002T-P0.5S  (value not drawn)
HW86  SPH-002T-P0.5S  (value not drawn)
HW87  SPH-002T-P0.5S  (value not drawn)
HW88  SPH-002T-P0.5S  (value not drawn)
HW89  SPH-002T-P0.5S  (value not drawn)
HW90  SPH-002T-P0.5S  (value not drawn)
HW91  SPH-002T-P0.5S  (value not drawn)
HW92  SPH-002T-P0.5S  (value not drawn)
HW93  SPH-002T-P0.5S  (value not drawn)
HW94  SPH-002T-P0.5S  (value not drawn)
J2#2  JST_PH 2.0 Male Header  [JST-B2B-PH-K-S_V]
J4#2  0022285034  [0022285034]
P1  JST_PH 2.0 Male Header  [JST-B2B-PH-K-S_V]
P3#2  PHR-2  [FP-PHR-2-MFG]
P4#2  PHR-4  [FP-PHR-4-MFG]
P5#2  PHR-4  [FP-PHR-4-MFG]
P6#2  PHR-4  [FP-PHR-4-MFG]
P7#2  B4B-PH-K-S(LF)(SN)  [JST-B4B-PH-K-S_V]
P8#2  B4B-PH-K-S(LF)(SN)  [JST-B4B-PH-K-S_V]
P9#2  B4B-PH-K-S(LF)(SN)  [JST-B4B-PH-K-S_V]
P10#2  22-01-3037  [FP-22-01-3037-MFG]
P11#2  22-01-3037  [FP-22-01-3037-MFG]
PB5  Arcade Button RED LED 30mm
PB6  Arcade Button GREEN LED 30mm
PB7  Arcade Button YELLOW LED 30mm
PB8  Arcade Button BLUE LED 30mm
U7#2  WS2812B LED matrix, 16x4

### Blocks framed on the sheet
LED MATRIX CONNECTION TO HEADER: J4#2 P10#2 P11#2 U7#2
BATTERY CONNECTION TO HEADER: BATT1 J2#2

### Nets

Not connected (* = marked no-connect by the designer): J2#2 1 2; J4#2 1 2 3; P1 1 2; P7#2 1 2 3 4; P8#2 1 2 3 4; P9#2 1 2 3 4; PB5 1(SWITCH_HIGH) 2(SWITCH_LOW) 3(LED_ANODE) 4(LED_CATHODE); PB6 1(SWITCH_HIGH) 2(SWITCH_LOW) 3(LED_ANODE) 4(LED_CATHODE); PB7 1(SWITCH_HIGH) 2(SWITCH_LOW) 3(LED_ANODE) 4(LED_CATHODE); PB8 1(SWITCH_HIGH) 2(SWITCH_LOW) 3(LED_ANODE) 4(LED_CATHODE); U7#2 1(5V) 2(DIN) 3(GND)

### Notes on the sheet
- ARCADE PUSHBUTTONS CONNECTION TO HEADERS
- (near P11#2) 3
- (near P11#2) 2
- (near P11#2) 1
- Female terminal connectors P3, P5, P4, P6, P11, P10 are inserted into keyed male terminal connectors P1, P9, P7, P8, J4 and U7 respectively.
- (near P10#2) 1
- (near P10#2) 2
- (near P10#2) 3
- LED SWITCH LOWSIDE TERMINAL
- LED SWITCH HIGHSIDE TERMINAL
- LED ANODE TERMINAL
- LED CATHODE TERMINAL
- BATTERY, ARCADE PUSHBUTTONS AND LED MATRIX WIRING DIAGRAM
- BATT1 has integrated female terminal which interfaces with J2 (Male JST PH 2.0 terminal).  When battery operation is required, inserting BATT1 terminal into J2 will supply battery power to device.
- 1
- 12
- OLIVER CARNEW
- (in symbol CMP-05417-000012-1) +; -
- (in symbol CMP-17439-000059-1) 2; 3

### Library data of the parts
BATT1 = CMP-05417-000012-1: BATTERY LITHIUM 3V COIN 12.5MM; Manufacturer: Panasonic; Manufacturer Part Number: BR1225; ComponentLink2Description: Datasheet; Octopart: https://octopart.com/br1225-panasonic-39386830; Device Class L3: unset; Device Class L2: unset; ComponentLink2URL: https://industrial.panasonic.com/cdbs/www-data/pdf2/AAA4000/AAA4000C206.pdf; Temperature Range High: +80°C; Device Class L1: Passive Components; Mouser Description: Coin Cell Battery 3V 12 X 2.5 mm 48mA; Automotive: No; Category: Batt; Temperature Range Low: -30°C; Temperature: -30°C to +80°C; Digikey Description: BATTERY LITHIUM 3V COIN 12.5MM; Package: BR1225
HW65-HW80 = JST LTO-1.0T-110N-8: JST LTO Uninsulated Female Spade Connector / Receptacle / 2.8 x 0.5mm Tab Size
J2#2 P1 = CMP-2000-05162-1: Male Header, Pitch 2 mm, 1 x 2 Position, Height 6 mm, Tail Length 3.4 mm, -25 to 85 degC, RoHS, Bulk B2B-PH-K-S(LF)(SN); Manufacturer: JST; Pitch: 2mm; Style/Orientation: StraightHeader/Plug; No of Positions: 2; Datasheet Version: Nov-08; Datasheet URL: http://datasheet.octopart.com/B2B-PH-K-S%28LF%29%28SN%29-JST-datasheet-8324864.pdf; Manufacturer URL: http://www.jst.com/home2.html; Type: ShroudedHeader; Termination: Crimp
J4#2 = 0022285034: Connector; Manufacturer_Name: Molex; Datasheet Link: https://www.molex.com/content/dam/molex/molex-dot-com/products/automated/en-us/salesdrawingpdf/423/42375/022285034_sd.pdf?inline; Height: 10.67mm; Manufacturer_Part_Number: 0022285034; Arrow Part Number: 0022285034; Arrow Price/Stock: https://www.arrow.com/en/products/0022285034/molex?utm_currency=USD&region=nac
P3#2 = CMP-17439-000064-1: CONN HOUSING PH 2POS 2MM WHITE; Wire Gauge (Min): 24AWG; Number of Positions: 2; Gender: Female; Working Voltage: 100V; Contact Resistance: 10mR; Connector Type: Receptacle; Wire Gauge (Max): 30AWG; Max Current Rating: 2A; Insulation Resistance: 1GR; REACH SVHC: No SVHC; Contact Plating: Tin; Contact Type: Female Socket; Housing Material: Polyamide; Height: 6.4mm; Weight: 0.0625lb; Pitch: 2mm; Number of Rows: 1; Number of Contacts: 2; Mount: Free Hanging; Color: Natural; Lead Free: Lead Free; Max Operating Temperature: 85°C; Min Operating Temperature: -25°C; Length: 5.8mm; Depth: 6.85mm; Termination: Crimp; Number of Pins: 2; Max Voltage Rating (AC): 100V; Contact Material: Bronze; Housing Color: White; Current Rating: 2A; Fastening Type: Detent; Width: 4.5mm; Packaging: Bulk; Orientation: Straight; Series: PH; Flammability Rating: UL94 V-0; Material: Nylon
P4#2 P5#2 P6#2 = CMP-17439-000059-1: CONN HOUSING PH 4POS 2MM WHITE; Insulation Resistance: 1GR; Gender: Receptacle; Contact Resistance: 10mR; Number of Contacts: 4; Working Voltage: 100V; Current Rating: 2A; Min Operating Temperature: -25°C; Flammability Rating: UL94 V-0; Pitch: 2mm; Contact Plating: Tin; Lead Free: Lead Free; Color: Natural; Depth: 6.85mm; Weight: 0.0625lb; Length: 9.8mm; Height: 6.4mm; Housing Material: Nylon; REACH SVHC: No SVHC; Termination: Crimp; Series: PH; Housing Color: Natural; Connector Type: Receptacle; Number of Rows: 1; Contact Type: Female Socket; Number of Positions: 4; Fastening Type: Detent; Width: 4.5mm; Packaging: Bulk; Orientation: Straight; Material: Nylon; Max Operating Temperature: 85°C; Number of Pins: 4; Contact Material: Bronze; Mount: Free Hanging
P7#2 P8#2 P9#2 = CMP-2000-05165-1: Male Header, Pitch 2 mm, 1 x 4 Position, Height 6 mm, Tail Length 3.4 mm, -25 to 85 degC, RoHS, Bulk; Manufacturer: JST; No of Positions: 4; Style/Orientation: StraightHeader/Plug; Pitch: 2mm; Datasheet URL: http://datasheet.octopart.com/B4B-PH-K-S%28LF%29%28SN%29-JST-datasheet-10558886.pdf; Type: ShroudedHeader; Manufacturer URL: http://www.jst.com/home2.html; Termination: Crimp; Datasheet Version: Apr-09
P10#2 P11#2 = CMP-04776-000467-1: as P10#1 on sheet LED_MATRIX; Halogen Free: Low Halogen; Length: 8.18mm; Depth: 12.7mm; Housing Material: Nylon; Number of Rows: 1; Termination: Crimp; Height: 4.82mm; Orientation: Straight; Housing Color: White; Material: Nylon; Max Operating Temperature: 75°C; Fastening Type: Ramp; Radiation Hardening: No; Lead Free: Lead Free; Flammability Rating: UL94 V-0; Series: 2695; Min Operating Temperature: 0°C; Number of Contacts: 3; Packaging: Bulk; Contact Material: Bronze; Number of Positions: 3; Color: White; Contact Type: Non-Gendered; Mount: Free Hanging; Width: 4.82mm
PB5-PB8 = ARCADE_PUSHBUTTON: Ausleaf.
U7#2 = LED_MATRIX_CUTOFF

## Nets that join several sheets
+3V3: MCU_REV2 (16 pins), 3.3V_SUPPLY (C18.2 LED3.2 R19.1 U2.5), AUDIO_REV2 (6 pins), SD_CARD_REV2 (11 pins), INTERFACE_rev2 (5 pins), ARCADE_BUTTONS (6 pins), TP_STD_PERIPHERALS (JP4.1 TP3.1)
GND: MCU_REV2 (19 pins), POWER_BATT_REV2 (25 pins), POWER_REV2 (C19.1 C20.2 C21.2), 3.3V_SUPPLY (8 pins), AUDIO_REV2 (7 pins), SD_CARD_REV2 (C36.1 C37.1 C38.1 J5.6), INTERFACE_rev2 (11 pins), ARCADE_BUTTONS (14 pins), TP_STD_PERIPHERALS (JP4.2 TP5.1), LED_MATRIX (J4#1.3)
V_SYS_IN: 3.3V_SUPPLY (6 pins), ARCADE_BUTTONS (R14.2 R15.2 R21.2 R38.2), TP_STD_PERIPHERALS (TP4.1), LED_MATRIX (J4#1.1)
BLUE_PB: MCU_REV2 (U5.20), ARCADE_BUTTONS (C42.2 P9#1.2 R42.2)
GREEN_PB: MCU_REV2 (U5.19), ARCADE_BUTTONS (C40.2 P9#1.3 R40.2)
LED_B: MCU_REV2 (U5.31), ARCADE_BUTTONS (R35.2)
LED_G: MCU_REV2 (U5.29), ARCADE_BUTTONS (R22.2)
LED_R: MCU_REV2 (U5.30), ARCADE_BUTTONS (R45.2)
LED_Y: MCU_REV2 (U5.38), ARCADE_BUTTONS (R36.2)
NetJ4#1_2: MCU_REV2 (U5.11), LED_MATRIX (J4#1.2)
NetJP1_1: POWER_REV2 (JP1.1 JP5.1), 3.3V_SUPPLY (SW7.3)
NetR18_1: MCU_REV2 (R18.1), 3.3V_SUPPLY (U6.7)
NetR20_1: MCU_REV2 (R20.1), 3.3V_SUPPLY (U6.8)
NetR23_2: MCU_REV2 (U5.46), 3.3V_SUPPLY (R23.2)
NetR31_1: MCU_REV2 (U5.17), SD_CARD_REV2 (R31.1)
NetU3_1: MCU_REV2 (U5.28), AUDIO_REV2 (U3.1)
NetU3_14: MCU_REV2 (U5.25), AUDIO_REV2 (U3.14)
NetU3_16: MCU_REV2 (U5.26), AUDIO_REV2 (U3.16)
PB_D: MCU_REV2 (U5.14), INTERFACE_rev2 (C4.2 SW4.2 SW5.2)
PB_L: MCU_REV2 (U5.45), INTERFACE_rev2 (C3.2 SW3.2 SW4.4)
PB_Red: MCU_REV2 (U5.18), ARCADE_BUTTONS (C41.2 P9#1.4 R41.2)
PB_Ri: MCU_REV2 (U5.41), INTERFACE_rev2 (C1.2 SW1.2 SW4.6)
PB_Sel: MCU_REV2 (U5.21), INTERFACE_rev2 (C2.2 SW2.2 SW4.3)
PB_U: MCU_REV2 (U5.10), INTERFACE_rev2 (C5.2 SW4.5 SW6.2)
PB_Y: MCU_REV2 (U5.40), ARCADE_BUTTONS (C39.2 P9#1.1 R39.2)
SD_CD: MCU_REV2 (U5.2), SD_CARD_REV2 (R25.1 R34.1)
SD_CS: MCU_REV2 (U5.22), SD_CARD_REV2 (J5.2 R29.1)
SD_MISO: MCU_REV2 (U5.16), SD_CARD_REV2 (R27.1 R33.1)
SD_SCK: MCU_REV2 (U5.15), SD_CARD_REV2 (R32.1)
SYS: POWER_BATT_REV2 (8 pins), 3.3V_SUPPLY (JP2.1 JP7.1)
V_BATT: POWER_BATT_REV2 (6 pins), 3.3V_SUPPLY (F1.2)
VIN: POWER_BATT_REV2 (7 pins), POWER_REV2 (C20.1 C21.1 FB1.2)